# Altium schematic sheet Connectors.SchDoc
size A
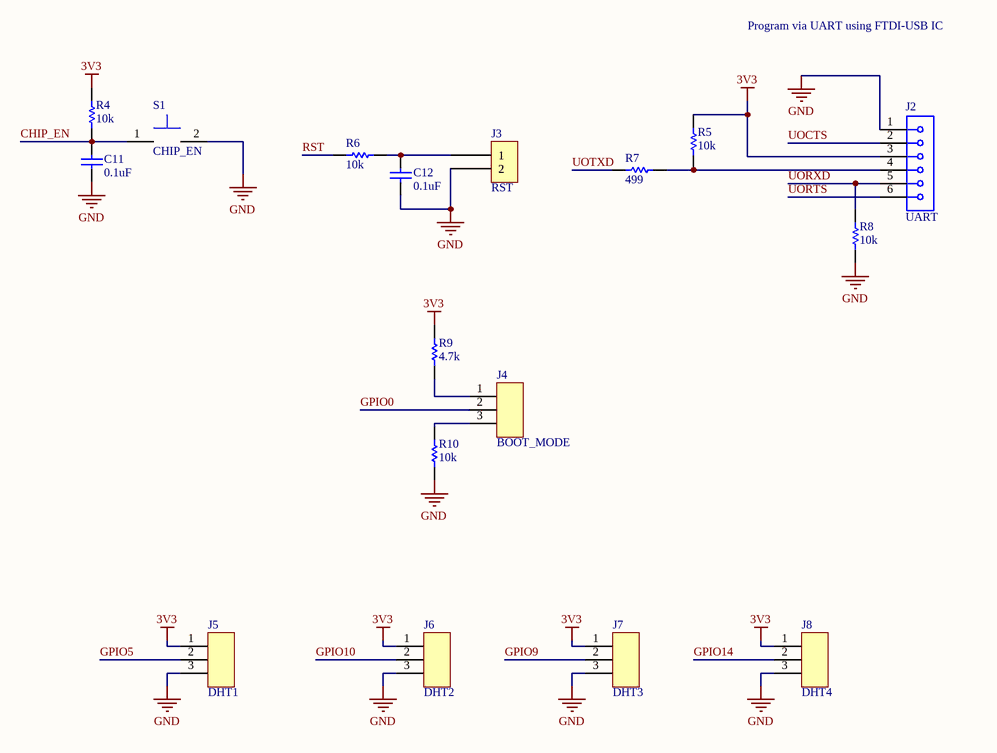
[diagram p0: Connectors.SchDoc]

## Parts
C11  0.1uF  [PCB-oygqt4xf3sesynjclq4r-1]
C12  0.1uF  [PCB-oygqt4xf3sesynjclq4r-1]
J2  UART  [PCB-di8nzhz8ya7afv8i1myi-1]
J3  RST  [Jumper]
J4  BOOT_MODE  [PCB-s0hfil65plaomi4ibvcw-1]
J5  DHT1  [PCB-s0hfil65plaomi4ibvcw-1]
J6  DHT2  [PCB-s0hfil65plaomi4ibvcw-1]
J7  DHT3  [PCB-s0hfil65plaomi4ibvcw-1]
J8  DHT4  [PCB-s0hfil65plaomi4ibvcw-1]
R4  10k  [PCB-urbe6pl2f36u5sj9z9e0-1]
R5  10k  [PCB-urbe6pl2f36u5sj9z9e0-1]
R6  10k  [PCB-urbe6pl2f36u5sj9z9e0-1]
R7  499  [RESC1609X50X30ML10T20]
R8  10k  [PCB-urbe6pl2f36u5sj9z9e0-1]
R9  4.7k  [RESC1608X55X30ML20T10]
R10  10k  [PCB-urbe6pl2f36u5sj9z9e0-1]
S1  CHIP_EN  [PCB-xzcf6rj7v3ysitq80b7l-1]

## Nets
3V3: J2.3 J5.1 J6.1 J7.1 J8.1 R4.2 R5.1 R9.2
GND: C11.1 C12.1 J2.1 J3.2 J5.3 J6.3 J7.3 J8.3 R8.2 R10.2 S1.2
CHIP_EN: C11.2 R4.1 S1.1
GPIO0: J4.2
GPIO5: J5.2
GPIO9: J7.2
GPIO10: J6.2
GPIO14: J8.2
RST: R6.2
UOCTS: J2.2
UORTS: J2.6
UORXD: J2.5 R8.1
UOTXD: R7.1
NetC12_2: C12.2 J3.1 R6.1
NetJ2_4: J2.4 R5.2 R7.2
NetJ4_1: J4.1 R9.1
NetJ4_3: J4.3 R10.1

## Notes on the sheet
- Program via UART using FTDI-USB IC

## Library data of the parts
C11 C12 = CMP-2758844-5: 0.1uF, ±10%, 50V, X7R, 0805, Multilayer Ceramic Capacitor; Manufacturer Part Number: CL21B104KBCNNNC; Lead-Free Status: Lead Free; Voltage Rating (DC): 50.0 V; Capacitance: 100 nF; Operating Temperature: -55.0 °C (min); RoHS: Compliant; Octopart URL: https://octopart.com/cl21b104kbcnnnc-samsung-9299352; Mounting Style: Surface Mount; Case/Package: 0805; Dielectric Characteristic: X7R; OctopartID: 94265da154d84be1
J2 = CMP-ea272149382c35e0-4: Conn; Rect; UnshroudedHdr; 6Cnts; ThruHole; BergStik; 2.54mmPin-Spng; Vert; 1-Row
J3 = CMP-08fac3900112d73d-14: 2 pin male header straight tht; Number of Positions: 2; Contact Plating: Gold; Mounting Style: Through Hole, Solder; Material: Thermoplastic
J4-J8 = CMP-8a90426ffa175557-34: THT Vertical Pin Header WR-PHD, Pitch 2.54 mm, Single Row, 3 pins; Lead-Free Status: Lead Free; Dielectric Withstanding Voltage: 500 V; Orientation: Vertical
R4-R6 R8 R10 = CMP-1974d512ef63c6b3-1: Res, AEC-Q200, Thick Film, 10K, 5%, 0603; Manufacturer Part Number: CRGCQ0603J10K; Packaging: Cut Tape (CT); Resistance Tolerance: ±5%; Lifecycle Status: Not Listed by Manufacturer; OctopartID: 1974d512ef63c6b3; Octopart URL: https://octopart.com/crgcq0603j10k-te+connectivity-91018097
R7 = CMP-3835606-2: Res Thick Film 0603 499 Ohm 1% 1/10W ±100ppm/C Molded SMD Paper T/R; Manufacturer Part Number: CRCW0603499RFKEA; Lead-Free Status: Lead Free; Power Rating: 0.1 W; Resistance: 499.0 Ω; Temperature Coefficient: 100.0 ppm/°C; Voltage Rating (DC): 75.0 V; Case/Package: 0603; Mounting Style: Surface Mount; Number of Pins: 2; Octopart Url: https://octopart.com/crcw0603499rfkea-vishay-39781368; OctopartID: 6f40a41549deb087; REACH SVHC Compliance: No SVHC; Resistance Tolerance: ±1%; RoHS: Compliant; Size-Height: 0.00045 m; Size-Length: 0.00155 m; Size-Width: 0.00085 m
R9 = CMP-2823469-2: Res Thick Film 0603 4.7K Ohm 5% 0.1W(1/10W) ±200ppm/C Molded SMD Automotive Punched Paper T/R; Manufacturer Part Number: RK73B1JTTD472J; Lead-Free Status: Lead Free; Resistance: 4700.0 Ω; Temperature Coefficient: 200.0 ppm/°C; Voltage Rating (DC): 50.0 V; Case/Package: 0603; Mounting Style: Surface Mount; Octopart Url: https://octopart.com/rk73b1jttd472j-koa+speer-2166243; OctopartID: de05172ef68001c2; Power Rating: 0.1 W; Resistance Tolerance: ±5%; RoHS: Compliant; Size-Length: 0.0016 m; Size-Width: 0.0008 m
S1 = CMP-32abff024869ed6c-2: Switch Tactile Spst-No 0.02a 15v